# Altium schematic sheet Main.SchDoc
size A4; Organization: Altium Limited; Address1: 3 Minna Close; Address2: Belrose; Address3: NSW 2085; Address4: Australia
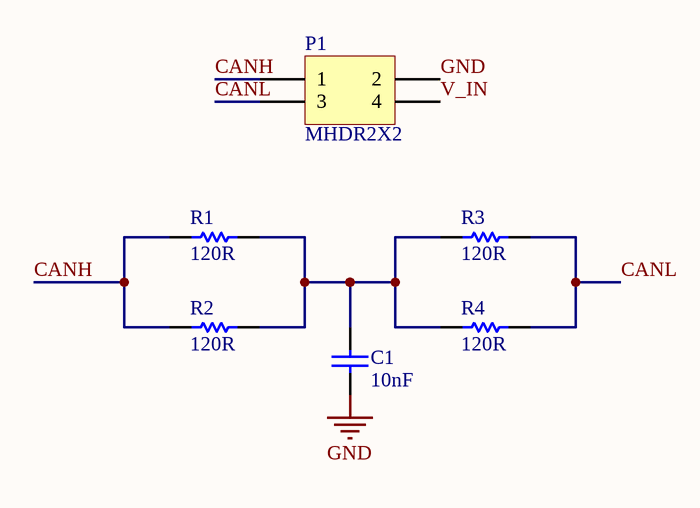
[diagram p0: Main.SchDoc]

## Parts
C1  10nF  [CC0603]
P1  MHDR2X2  [MHDR2X2]
R1  120R  [R0603]
R2  120R  [R0603]
R3  120R  [R0603]
R4  120R  [R0603]

## Nets
GND: C1.1 P1.2
CANH: P1.1 R1.1 R2.1
CANL: P1.3 R3.2 R4.2
V_IN: P1.4
NetC1_2: C1.2 R1.2 R2.2 R3.1 R4.1

## Notes on the sheet
- Title
- Size:
- Date:
- A4
- Number:
- Time:
- Revision:
- Sheet
- of
- File:

## Library data of the parts
C1 = 10nF_CC0603: 0603 Capacitor; Supplier_Component_Code: RC-P097; published: 28/03/2007 10:54:57 a.m.; Supplier_Name: Soanar Plus; price: 0.09; value: 10nF; Part Number: 10nF_CC0603; Component Kind: Standard; Component Type: Standard; Designator: 10nF_CC0603; Pin Count: 2
P1 = MHDR2X2: Header, 2-Pin, Dual row; LatestRevisionDate: 17-Jul-2002; LatestRevisionNote: Re-released for DXP Platform.; Publisher: Altium Limited
R1-R4 = 120R_R0603: 0603 Resistor; ECE_Component_Code: 120R_R0603; value: 120R; Supplier_Component_Code: RS-S051; published: 12/03/2007 11:34:34 a.m.; Supplier_Name: Soanar Plus; price: 0.08; Part Number: 120R_R0603; Component Kind: Standard; Component Type: Standard; Designator: 120R_R0603; Pin Count: 2